# EAGLE design V1 (EAGLE 6.4)
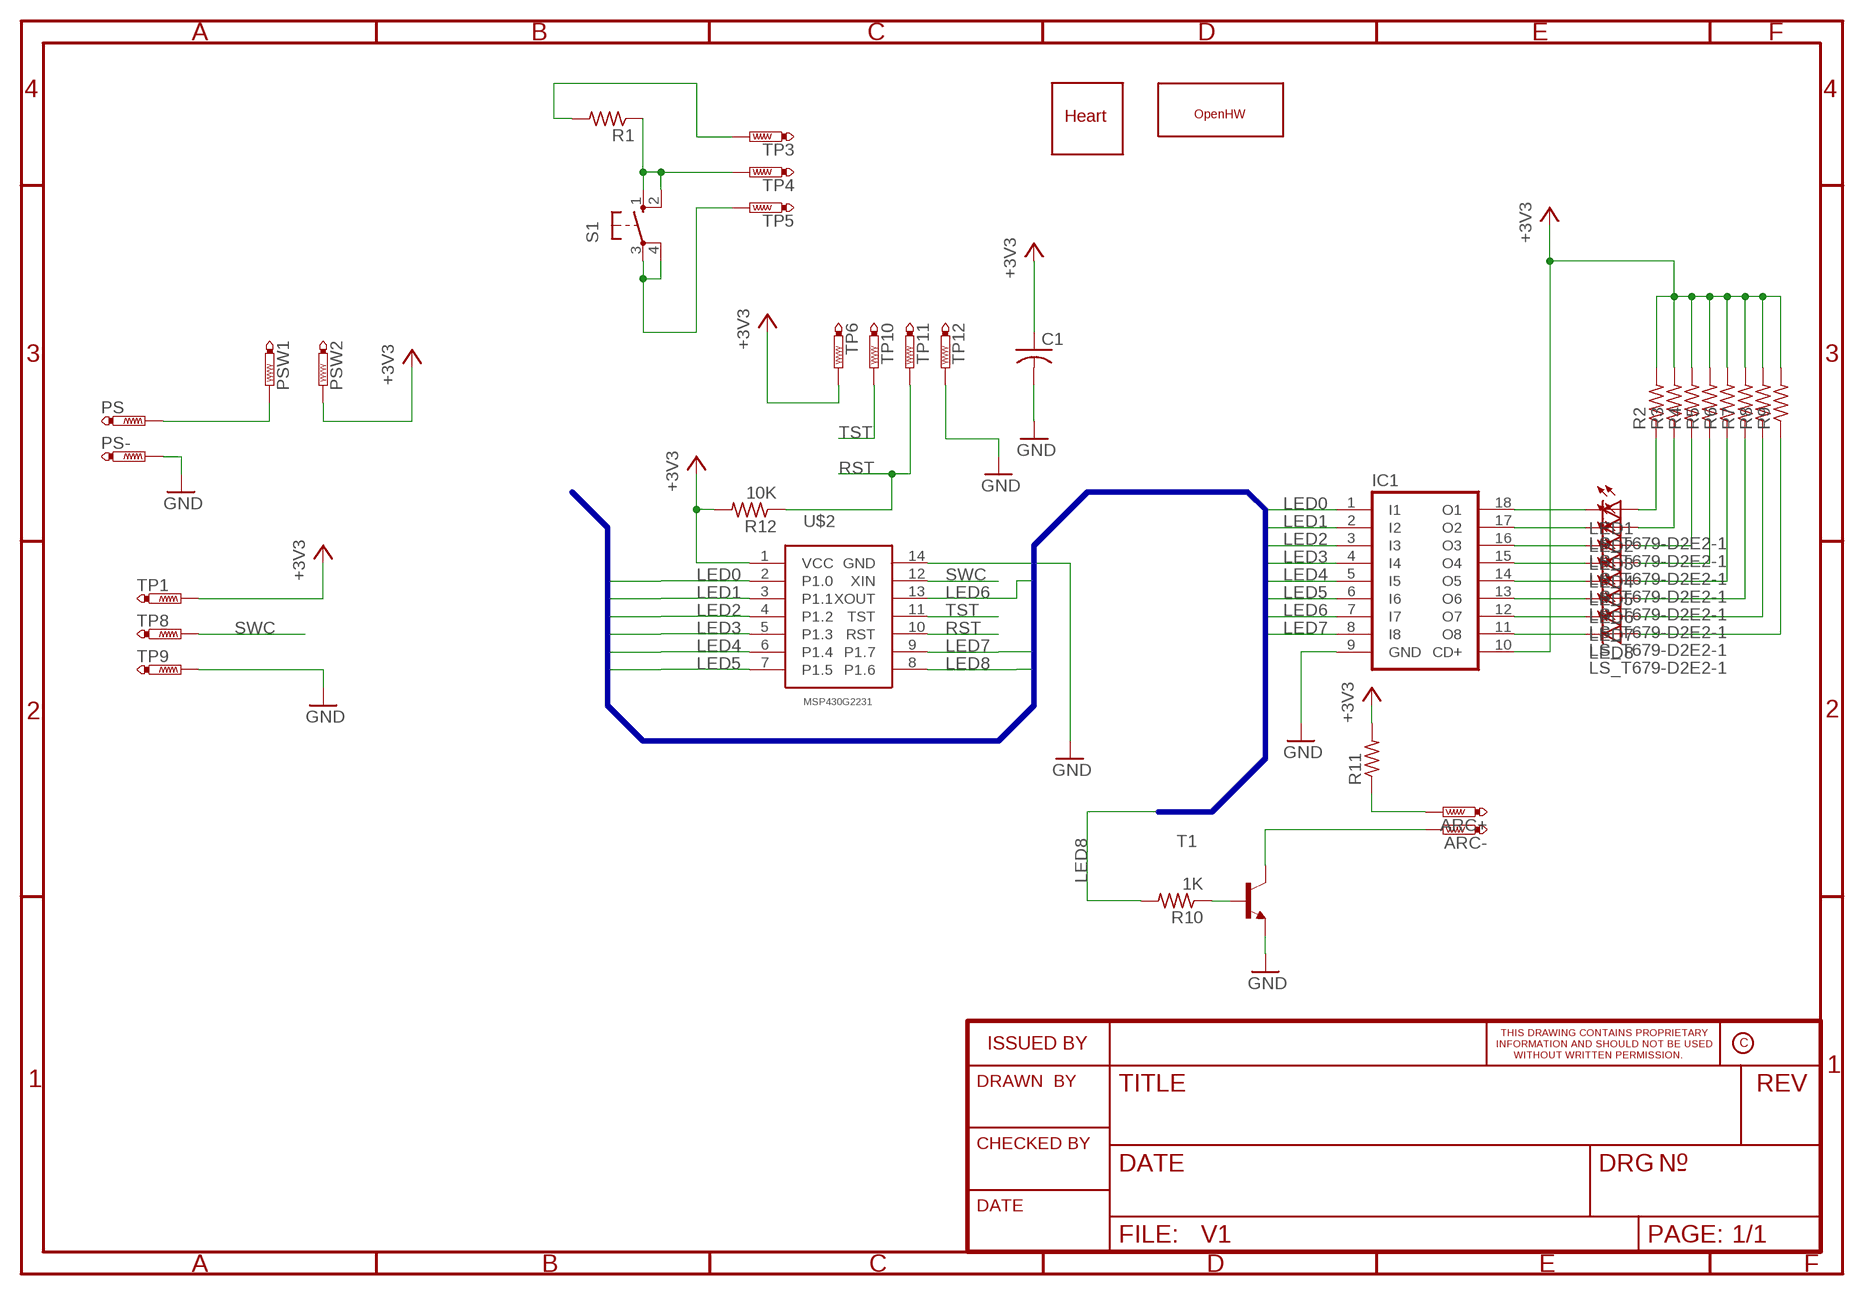
[diagram p0: schematic, sheet 1]

## Parts
ARC+  PTR1TP20SQ  [TP20SQ]
ARC-  PTR1TP20SQ  [TP20SQ]
C1  CAP0805  [C0805]
IC1  ULN2803A  [DIL18]
LED1  LS_T679-D2E2-1  [PLCC2]
LED2  LS_T679-D2E2-1  [PLCC2]
LED3  LS_T679-D2E2-1  [PLCC2]
LED4  LS_T679-D2E2-1  [PLCC2]
LED5  LS_T679-D2E2-1  [PLCC2]
LED6  LS_T679-D2E2-1  [PLCC2]
LED7  LS_T679-D2E2-1  [PLCC2]
LED8  LS_T679-D2E2-1  [PLCC2]
PS  PTR1TP20SQ  [TP20SQ]
PS-  PTR1TP20SQ  [TP20SQ]
PSW1  PTR1TP20SQ  [TP20SQ]
PSW2  PTR1TP20SQ  [TP20SQ]
R1  RESISTOR0805  [R0805]
R2  RESISTOR0805  [R0805]
R3  RESISTOR0805  [R0805]
R4  RESISTOR0805  [R0805]
R5  RESISTOR0805  [R0805]
R6  RESISTOR0805  [R0805]
R7  RESISTOR0207/10  [0207/10]
R8  RESISTOR0207/7  [0207/7]
R9  RESISTOR0805  [R0805]
R10  1K  RESISTOR0207/7  [0207/7]
R11  RESISTOR0805  [R0805]
R12  10K  RESISTOR0805  [R0805]
S1  40-XX  [B3F-40XX]
T1  MMBT3904LT1-NPN-SOT23-BEC  [SOT23-BEC]
TP1  PTR1TP20SQ  [TP20SQ]
TP3  PTR1TP20SQ  [TP20SQ]
TP4  PTR1TP20SQ  [TP20SQ]
TP5  PTR1TP20SQ  [TP20SQ]
TP6  PTR1TP20SQ  [TP20SQ]
TP8  PTR1TP20SQ  [TP20SQ]
TP9  PTR1TP20SQ  [TP20SQ]
TP10  PTR1TP20SQ  [TP20SQ]
TP11  PTR1TP20SQ  [TP20SQ]
TP12  PTR1TP20SQ  [TP20SQ]
U$1  HEARTTOPLAYER  [HEART]
U$2  MSP430G2231SOP  [G2231TSSOP]
U$3  OPENHWLOGO1  [OPENHW]

## Nets
+3V3: C1.1 IC1.10(CD+) PSW2.TP R2.2 R3.2 R4.2 R5.2 R6.2 R7.2 R8.2 R9.2 R11.2 R12.2 TP1.TP TP6.TP U$2.1(VCC)
GND: C1.2 IC1.9(GND) PS-.TP T1.E TP9.TP TP12.TP U$2.14(GND)
LED0: IC1.1(I1) U$2.2(P1.0)
LED1: IC1.2(I2) U$2.3(P1.1)
LED2: IC1.3(I3) U$2.4(P1.2)
LED3: IC1.4(I4) U$2.5(P1.3)
LED4: IC1.5(I5) U$2.6(P1.4)
LED5: IC1.6(I6) U$2.7(P1.5)
LED6: IC1.7(I7) U$2.13(XOUT)
LED7: IC1.8(I8) U$2.9(P1.7)
LED8: R10.2 U$2.8(P1.6)
N$1: R10.1 T1.B
N$2: PS.TP PSW1.TP
N$3: ARC-.TP T1.C
N$4: ARC+.TP R11.1
N$6: IC1.18(O1) LED1.C
N$7: IC1.17(O2) LED2.C
N$8: IC1.16(O3) LED3.C
N$9: IC1.15(O4) LED4.C
N$10: IC1.14(O5) LED5.C
N$11: IC1.13(O6) LED6.C
N$12: IC1.12(O7) LED7.C
N$13: IC1.11(O8) LED8.C
N$14: LED1.A R2.1
N$15: LED2.A R3.1
N$16: LED3.A R4.1
N$17: LED4.A R5.1
N$18: LED5.A R6.1
N$19: LED6.A R7.1
N$20: LED7.A R8.1
N$21: LED8.A R9.1
N$22: S1.3(P) S1.4(P1) TP5.TP
N$23: R1.1 S1.1(S) S1.2(S1) TP4.TP
N$24: R1.2 TP3.TP
RST: R12.1 TP11.TP U$2.10(RST)
SWC: TP8.TP U$2.12(XIN)
TST: TP10.TP U$2.11(TST)

## Buses
LED[0..8]

## Library data of the parts
ARC+ ARC- PS PS- PSW1 PSW2 TP1 TP3-TP6 TP8-TP12 = testpad:PTR1: TEST PIN
C1 = CEDTv75:CAP
IC1 = uln-udn:ULN2803A: DRIVER ARRAY
LED1-LED8 = Rohit_Libsv2:*_T679-?-1: LC TOPLED® Low Current LED Source: http://catalog.osram-os.com .. LG_LS_LY_T679_OBS.pdf; COLOR: super-red
R1-R12 = Rohit_Libsv2:RESISTOR: Most commonly used Resistor Packages
S1 = CEDTv75:40-XX: OMRON SWITCH
T1 = transistor:*-NPN-: NPN Transistror BF959 corrected 2008.03.06
U$1 = Rohit_Libsv2:HEART: A heart made for those who love electronics and circuits! Show your love.. :D
U$2 = Rohit_Libsv2:MSP430G2231SOP
U$3 = Rohit_Libsv2:OPENHWLOGO

## Board
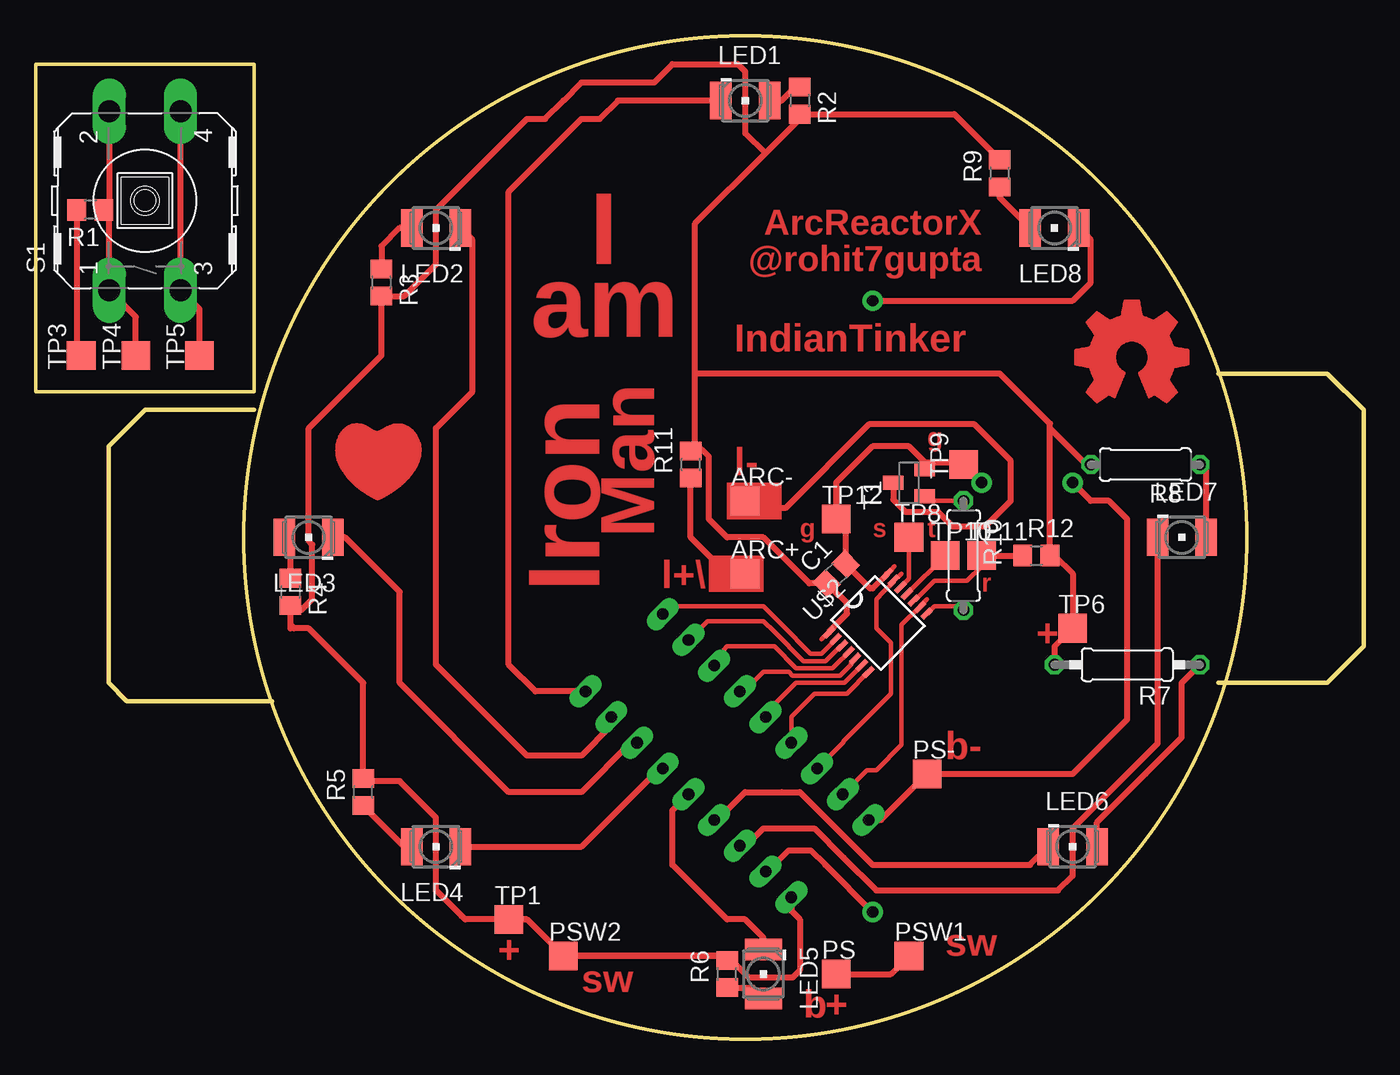
[diagram p1: board, top side]
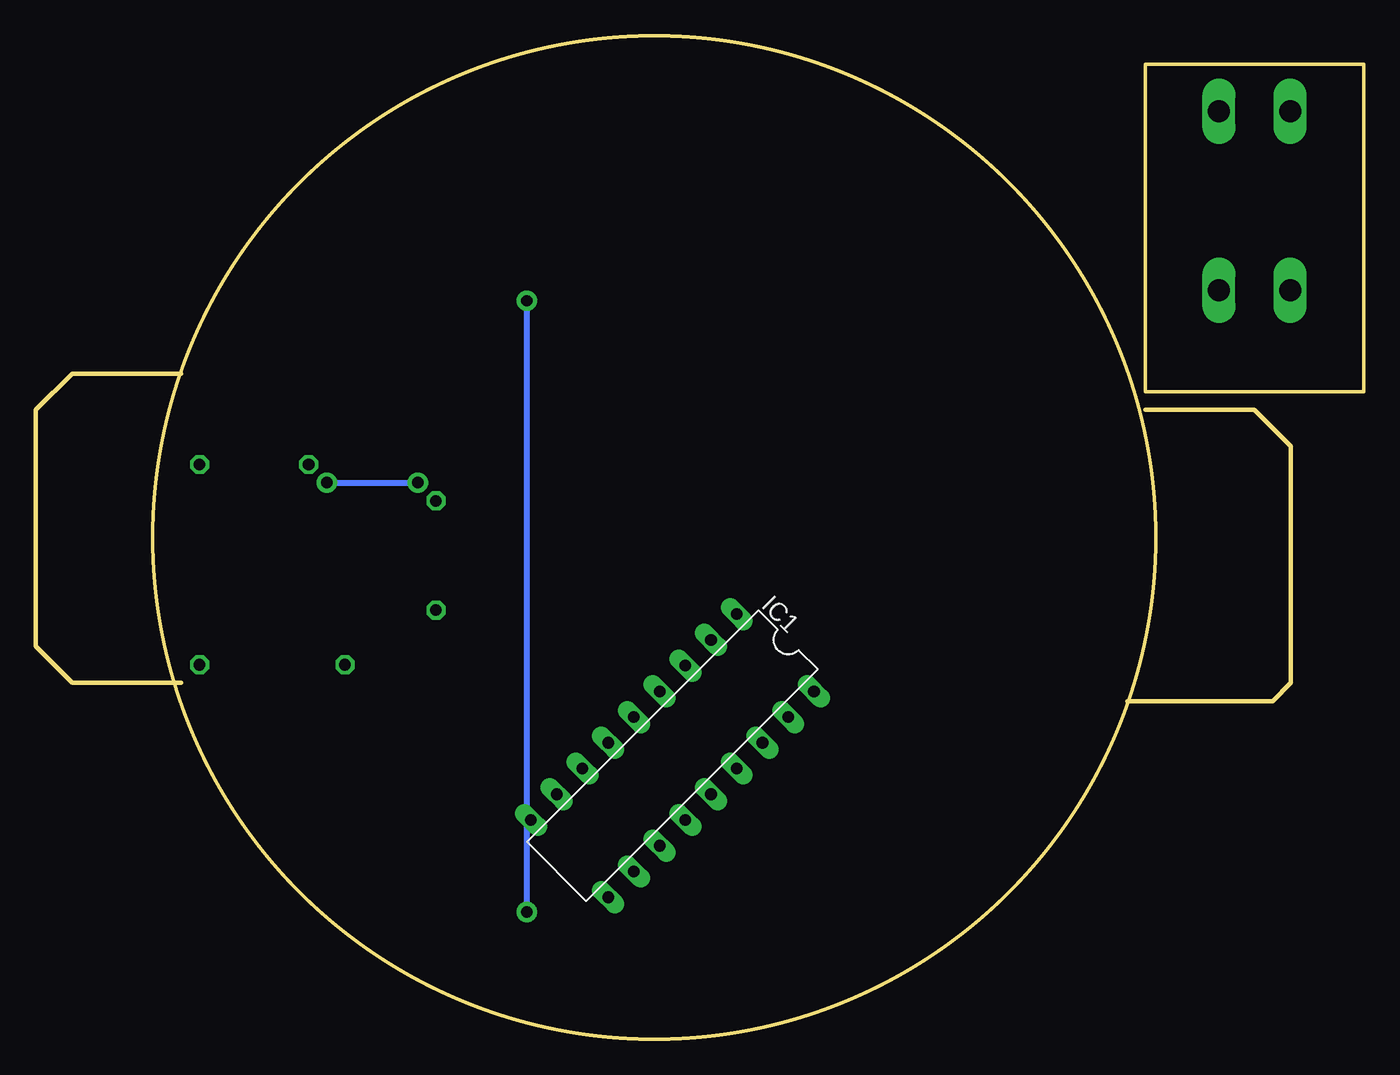
[diagram p2: board, bottom side, seen from below]

Size 92.71 x 70 mm. Coordinates in mm from the lower left corner, seen from the top.
Outline: 15.24,43.89 7.62,43.89 5.08,41.35 5.08,28.65 5.08,24.84 6.35,23.57 16.51,23.57
Outline: 82.55,46.43 90.17,46.43 92.71,43.89 92.71,27.38 90.17,24.84 82.55,24.84
Outline: 0,45.16 15.24,45.16 15.24,68.02 13.97,68.02 0,68.02 0,45.16
Outline: circle at 49.53,35 radius 35
Copper layers (1*16): Top 0.035mm / dielectric 1.5mm / Bottom 0.035mm
Design rules "default": minimum track width 10mil, minimum drill 24mil, track to track 8mil, track to pad 8mil, pad to pad 8mil, via to via 8mil, smd to smd 8mil, copper to edge 40mil, drill to drill 8mil, minimum pad ring 10mil, minimum via ring 8mil, stop-mask expansion 4mil, vias tented up to drill 0mil, thermal gap 10mil

### Footprints (pad centres in the part's own frame; a part is rotated, then mirrored left to right if it is on the bottom)
TP20SQ = smd 2 x 2: TP 0,0
C0805 = smd 1.3 x 1.5: 1 -0.95,0; 2 0.95,0
DIL18 = drill 0.813 long: 1 -10.16,-3.81; 2 -7.62,-3.81; 3 -5.08,-3.81; 4 -2.54,-3.81; 5 0,-3.81; 6 2.54,-3.81; 7 5.08,-3.81; 8 7.62,-3.81; 9 10.16,-3.81; 10 10.16,3.81; 11 7.62,3.81; 12 5.08,3.81; 13 2.54,3.81; 14 0,3.81; 15 -2.54,3.81; 16 -5.08,3.81; 17 -7.62,3.81; 18 -10.16,3.81
PLCC2 = smd 2.6 x 1.5: A 0,1.7; C 0,-1.7
R0805 = smd 1.3 x 1.5: 1 -0.95,0; 2 0.95,0
0207/10 = drill 0.813 octagon: 1 -5.08,0; 2 5.08,0
0207/7 = drill 0.813 octagon: 1 -3.81,0; 2 3.81,0
B3F-40XX = drill 1.524 long: 1 -6.248,2.489; 2 6.248,2.489; 3 -6.248,-2.489; 4 6.248,-2.489
SOT23-BEC = smd 1 x 1.4: B -0.95,-1.1; C 0,1.1; E 0.95,-1.1
G2231TSSOP = smd 0.9 x 0.35: 1 -2.875,1.95; 2 -2.875,1.3; 3 -2.875,0.65; 4 -2.875,0; 5 -2.875,-0.65; 6 -2.875,-1.3; 7 -2.875,-1.95; 8 2.875,-1.95; 9 2.875,-1.3; 10 2.875,-0.65; 11 2.875,0; 12 2.875,0.65; 13 2.875,1.3; 14 2.875,1.95

### Placement (x,y rotation side)
ARC+  49.53,32.46 0 top
ARC-  49.53,37.54 0 top
C1  55.88,32.46 45 top
IC1  48.26,19.76 225 bottom
LED1  49.53,65.48 270 top
LED2  27.94,56.59 90 top
LED3  19.05,35 90 top
LED4  27.94,13.41 90 top
LED5  50.8,4.52 180 top
LED6  72.39,13.41 270 top
LED7  80.01,35 270 top
LED8  71.12,56.59 90 top
PS  55.88,4.52 0 top
PS-  62.23,18.49 0 top
PSW1  60.96,5.79 0 top
PSW2  36.83,5.79 0 top
R1  3.81,57.86 180 top
R2  53.34,65.48 270 top
R3  24.13,52.78 270 top
R4  17.78,31.19 270 top
R5  22.86,17.22 90 top
R6  48.26,4.52 90 top
R7  76.2,26.11 180 top
R8  77.47,40.08 180 top
R9  67.31,60.4 90 top
R10  64.77,33.73 270 top
R11  45.72,40.08 90 top
R12  69.85,33.73 0 top
S1  7.62,58.49 90 top
T1  60.96,38.81 90 top
TP1  33.02,8.33 0 top
TP3  3.17,47.7 90 top
TP4  6.99,47.7 90 top
TP5  11.43,47.7 90 top
TP6  72.39,28.65 0 top
TP8  60.96,35 0 top
TP9  64.77,40.08 90 top
TP10  63.5,33.73 0 top
TP11  66.04,33.73 0 top
TP12  55.88,36.27 0 top
U$1  24.13,37.54 0 top
U$2  58.79,29.02 45 top
U$3  76.2,47.7 0 top

### Tracks (layer width: path | path; a pad name or v marks a point on that pad's centre or on a via)
+3V3
  Top 0.305: 54.86,27.89 55.63,28.65
  Top 0.406: U$2.1 55.38,28.4 55.63,28.65 56.64,29.67 56.64,30.43 56.13,30.94 56.06,30.94 C1.1 54.01,31.79 50.8,35 48.26,35 46.99,36.27 46.99,36.52 46.99,40.65 46.04,41.6 | R11.2 46.04,41.03 46.04,41.6 | R12.2 71.12,33.73 | 71.12,33.73 72.39,32.46 TP6.TP 71.12,27.38 R7.2 | 46.04,41.6 46.04,46.43 | 46.04,46.43 46.04,56.91 50.93,61.8 | 50.93,61.8 53.34,64.21 R2.2 64.13,64.53 R9.2 | R12.2 71.12,33.73 | 52.75,8.92 IC1.10 52.75,8.92 | 52.75,8.92 53.34,8.33 | 53.34,8.33 53.34,4.77 | 53.34,4.77 52.83,4.27 | 52.83,4.27 49.78,4.27 | 49.78,4.27 48.77,5.28 | 48.77,5.28 48.45,5.28 R6.2 47.94,5.79 37.08,5.79 | PSW2.TP 37.08,5.79 | 34.29,8.33 TP1.TP 32.51,8.33 | 34.29,8.33 PSW2.TP | 32.51,8.33 29.97,8.33 | 29.97,8.33 29.72,8.58 | 29.72,8.58 27.94,10.36 | 27.94,10.36 27.94,15.44 | 27.94,15.44 25.4,17.98 | 25.4,17.98 23.11,17.98 | 23.11,17.98 23.05,17.98 R5.2 22.86,24.84 | 22.86,24.84 19.05,28.65 | 19.05,28.65 17.78,28.65 17.78,28.9 | 17.78,28.9 R4.2 | 50.93,61.8 49.53,63.19 49.53,67.51 49.02,68.02 44.45,68.02 43.18,66.75 38.1,66.75 36.83,65.48 35.56,64.21 34.29,64.21 27.94,57.86 27.94,54.05 26.67,52.78 25.72,51.83 R3.2 24.13,47.7 19.05,42.62 19.05,34.75 19.3,34.49 19.3,30.68 18.54,29.92 18.29,29.92 17.78,30.43 17.78,30.68 17.78,28.9 | R12.2 70.8,42.62 | 70.8,42.62 70.8,42.94 67.31,46.43 46.04,46.43 | 52.75,8.92 53.34,8.33 | 53.34,8.33 53.34,4.77 | 53.34,4.77 52.83,4.27 | 52.83,4.27 49.78,4.27 | 49.78,4.27 48.77,5.28 | 48.77,5.28 48.26,5.79 37.08,5.79 | 37.08,5.79 PSW2.TP | PSW2.TP 34.29,8.33 | 34.29,8.33 32.51,8.33 | 32.51,8.33 29.97,8.33 | 29.97,8.33 29.72,8.58 | 29.72,8.58 27.94,10.36 | 27.94,10.36 27.94,15.44 | 27.94,15.44 25.4,17.98
  Top 0.406: 25.4,17.98 23.11,17.98 | 23.11,17.98 22.86,17.98 22.86,24.84 | 22.86,24.84 19.05,28.65 | 19.05,28.65 18.03,28.65 17.78,28.9 | R8.2 73.34,40.08 70.8,42.62
GND  (via drill 0.8 pad 1.42)
  Top 0.406: U$2.14 59.41,32.43 58.42,31.44 58.24,31.44 C1.2 56.55,35.6 TP12.TP 55.88,38.81 58.42,41.35 60.96,41.35 62.06,40.25 | IC1.9 59.01,15.27 PS-.TP 72.39,18.49 76.2,22.3 76.2,36.27 74.93,37.54 73.66,37.54 v72.39,38.81 | T1.E 62.06,40.25 | 62.06,40.25 64.6,40.25 TP9.TP v66.04,38.81
  Bottom 0.406: v72.39,38.81 v66.04,38.81
LED0
  Top 0.305: U$2.2 55.84,27.85 54.86,26.87 54.1,26.87 53.85,27.13 52.32,28.65 50.8,30.17 45.21,30.17 44.31,30.17 IC1.1
LED1
  Top 0.305: U$2.3 56.2,27.45 55.12,26.36 53.59,26.36 51.56,28.4 50.8,29.16 47.24,29.16 46.88,29.16 IC1.2
LED2
  Top 0.305: U$2.4 55.88,26.11 55.63,25.86 53.34,25.86 53.09,25.86 51.56,27.38 50.8,27.38 48.26,27.38 48.01,27.13 48.01,26.69 IC1.3
LED3
  Top 0.305: IC1.4 49.45,24.25 50.8,25.6 52.58,25.6 52.83,25.35 56.13,25.35 56.9,26.11 56.9,26.21 U$2.5
LED4
  Top 0.305: IC1.5 50.95,22.71 53.09,24.84 56.39,24.84 56.45,24.84 U$2.6
LED5
  Top 0.305: IC1.6 52.75,22.47 54.36,24.08 56.64,24.08 57.4,24.84 57.4,24.88 U$2.7
LED6
  Top 0.305: U$2.13 59.91,31.91 59.18,31.19 58.67,30.68 58.67,28.65 59.69,27.63 59.69,24.08 56.39,20.78 56.39,20.7 IC1.7
LED7
  Top 0.305: U$2.9 61.68,30.14 60.45,28.9 60.45,20.52 58.67,18.74 58.02,18.74 IC1.8
LED8
  Top 0.305: U$2.8 62.24,29.68 62.74,30.17 64.52,30.17 R10.2
N$1
  Top 0.305: R10.1 62.38,37.54 T1.B
N$2
  Top 0.406: PS.TP 59.69,4.52 PSW1.TP
N$3
  Top 0.406: T1.C 59.86,37.62 60.71,36.78 62.99,36.78 64.01,35.76 66.29,35.76 68.07,37.54 68.07,40.33 65.53,42.87 58.17,42.87 52.32,37.03 50.04,37.03 ARC-.TP
N$4
  Top 0.406: ARC+.TP 48.26,32.46 45.72,35 R11.1
N$5
  Top 0.305: 61.72,30.17 62.23,30.68
N$6
  Top 0.406: IC1.18 34.88,24.25 33.02,26.11 33.02,59.13 38.1,64.21 39.37,64.21 40.64,65.48 LED1.C
N$7
  Top 0.406: IC1.17 40.18,21.84 38.1,19.76 34.29,19.76 30.48,23.57 27.94,26.11 27.94,42.62 30.48,45.16 30.48,55.75 LED2.C
N$8
  Top 0.406: IC1.16 41.54,20.66 38.1,17.22 33.02,17.22 25.4,24.84 25.4,31.19 21.59,35 LED3.C
N$9
  Top 0.406: LED4.C 38.1,13.41 43.18,18.49 43.4,18.49 IC1.15
N$10
  Top 0.406: LED5.C 50.8,7.06 49.53,8.33 48.26,8.33 44.45,12.14 44.45,15.95 IC1.14
N$11
  Top 0.406: IC1.13 47.58,15.27 49.53,17.22 52.07,17.22 53.34,17.22 58.42,12.14 69.42,12.14 LED6.C
N$12
  Top 0.406: IC1.12 49.59,13.47 50.8,14.68 54.36,14.68 56.39,12.65 58.67,10.36 71.37,10.36 72.39,11.38 72.39,14.68 73.41,15.7 74.93,17.22 78.31,20.6 LED7.C
N$13  (via drill 0.8 pad 1.42)
  Top 0.406: IC1.11 51.1,11.68 52.58,13.16 54.1,13.16 55.12,12.14 v58.42,8.84 | v58.42,51.51 72.39,51.51 73.66,52.78 73.66,55.75 LED8.C
  Bottom 0.406: v58.42,8.84 v58.42,51.51
N$14
  Top 0.406: LED1.A 52.07,65.48 53.34,66.75 R2.1
N$15
  Top 0.406: LED2.A 25.4,56.59 24.13,55.32 R3.1
N$16
  Top 0.406: R4.1 17.78,34.57 LED3.A
N$17
  Top 0.406: LED4.A 25.72,13.41 R5.1
N$18
  Top 0.406: R6.1 50.05,3.57 LED5.A
N$19
  Top 0.406: LED6.A 74.09,15.11 77.47,18.49 80.01,21.03 80.01,24.84 R7.1
N$20
  Top 0.406: 81.28,34.57 LED7.A 81.71,39.65 R8.1
N$21
  Top 0.406: R9.1 67.31,58.7 LED8.A
N$22
  Top 0.406: TP5.TP 11.43,50.93 S1.3 S1.4
N$23
  Top 0.406: S1.2 5.13,58.23 R1.1 5.13,57.49 S1.1 6.99,50.39 TP4.TP
N$24
  Top 0.406: R1.2 2.86,48.02 TP3.TP
N$25
  Top 0.305: 59.69,32.71 59.94,32.97
N$26
  Top 0.305: 60.2,32.21 60.45,32.46
RST
  Top 0.305: U$2.10 61.38,30.59 62.74,31.95 65.02,31.95 66.04,32.97 TP11.TP
  Top 0.406: TP11.TP R12.1
SWC
  Top 0.305: TP8.TP 60.96,32.11 U$2.12
TST
  Top 0.305: U$2.11 TP10.TP
(copper drawn outside any net)
  shapes: Top area x2

### Text on the board
Top: I | ArcReactorX | @rohit7gupta | am | IndianTinker | g | l- | Man | g | s | t | Iron | l+\ | r | + | b- | + | sw | sw | b | +